# EAGLE design sold (EAGLE 7.6.0)
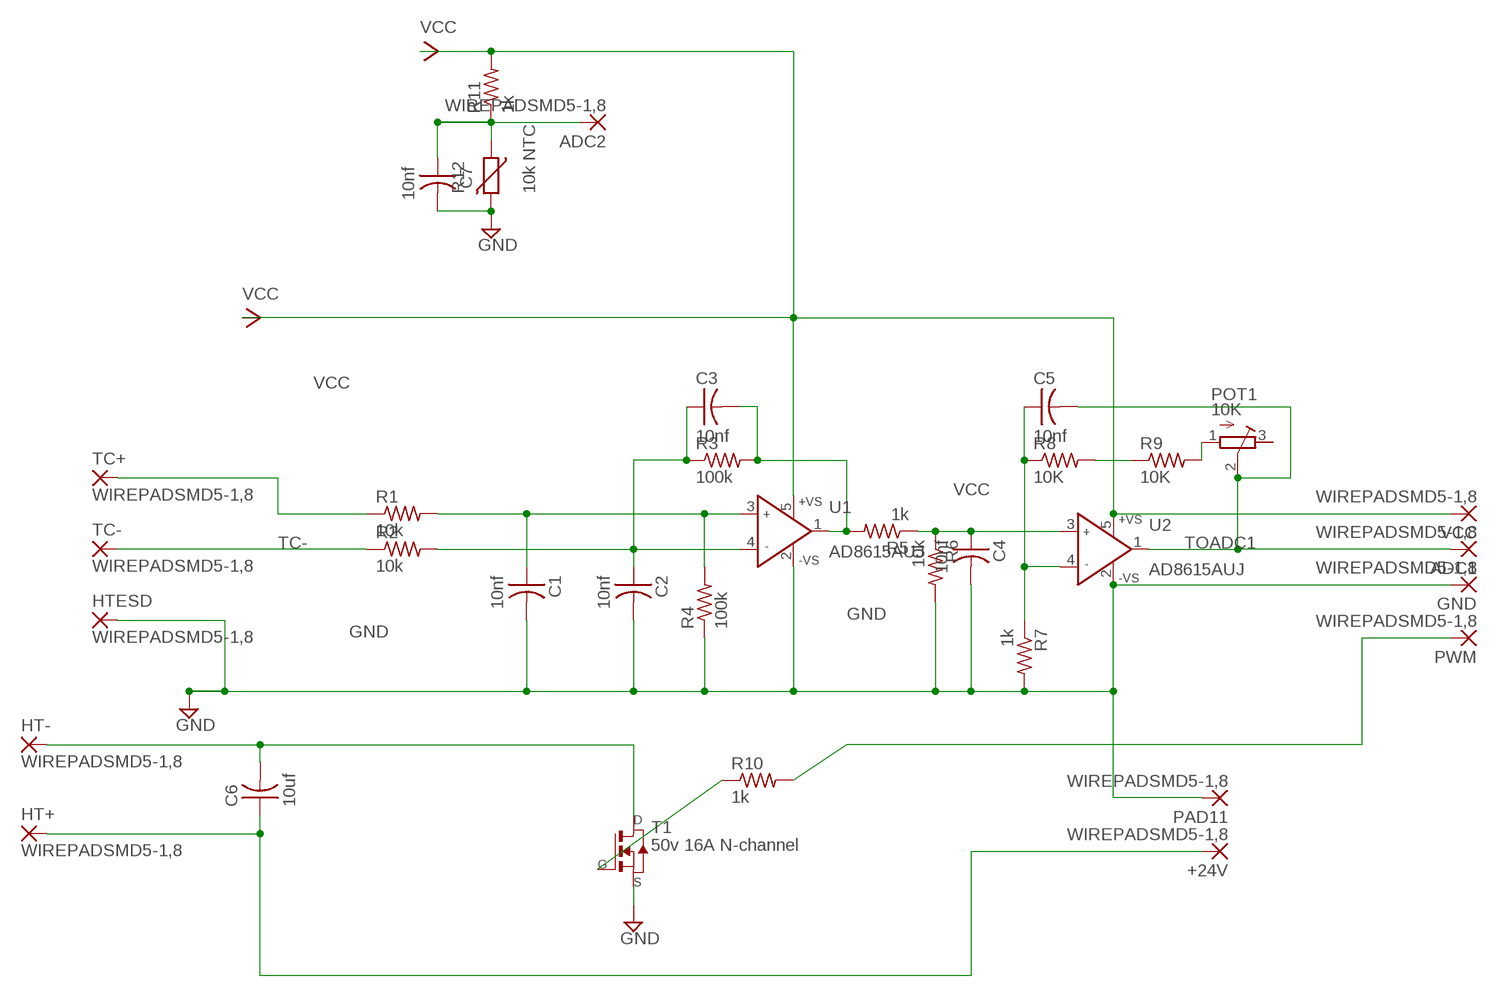
[diagram p0: schematic, sheet 1]

## Parts
+24V  WIREPADSMD5-1,8  [5-1,8]
ADC1  WIREPADSMD5-1,8  [5-1,8]
ADC2  WIREPADSMD5-1,8  [5-1,8]
C1  10nf  CAP-US1206FAB  [C1206FAB]
C2  10nf  CAP-US1206FAB  [C1206FAB]
C3  10nf  CAP-US1206FAB  [C1206FAB]
C4  10nf  CAP-US1206FAB  [C1206FAB]
C5  10nf  CAP-US1206FAB  [C1206FAB]
C6  10uf  CAP-US1206FAB  [C1206FAB]
C7  10nf  CAP-US1206FAB  [C1206FAB]
GND  WIREPADSMD5-1,8  [5-1,8]
HT+  WIREPADSMD5-1,8  [5-1,8]
HT-  WIREPADSMD5-1,8  [5-1,8]
HTESD  WIREPADSMD5-1,8  [5-1,8]
PAD11  WIREPADSMD5-1,8  [5-1,8]
POT1  10K  R-TRIMM3103  [RTRIM3103]
PWM  WIREPADSMD5-1,8  [5-1,8]
R1  10k  RES-US1206FAB  [R1206FAB]
R2  10k  RES-US1206FAB  [R1206FAB]
R3  100k  RES-US1206FAB  [R1206FAB]
R4  100k  RES-US1206FAB  [R1206FAB]
R5  1k  RES-US1206FAB  [R1206FAB]
R6  10k  RES-US1206FAB  [R1206FAB]
R7  1k  RES-US1206FAB  [R1206FAB]
R8  10K  RES-US1206FAB  [R1206FAB]
R9  10K  RES-US1206FAB  [R1206FAB]
R10  1k  RES-US1206FAB  [R1206FAB]
R11  1k  RES-US1206FAB  [R1206FAB]
R12  10k NTC  VARISTORCN1206  [CT/CN1206]
T1  50v 16A N-channel  NMOSFETTO252  [TO252]
TC+  WIREPADSMD5-1,8  [5-1,8]
TC-  WIREPADSMD5-1,8  [5-1,8]
U1  AD8615AUJ  [TSOT23-5]
U2  AD8615AUJ  [TSOT23-5]
VCC  WIREPADSMD5-1,8  [5-1,8]

## Nets
GND: C1.2 C2.2 C4.2 C7.2 GND.1(P) HTESD.1(P) PAD11.1(P) R4.1 R6.2 R7.2 R12.2 T1.2(S) U1.2(-VS) U2.2(-VS)
N$1: C4.1 R5.1 R6.1 U2.3(IN+)
N$2: C2.1 C3.1 R2.2 R3.1 U1.4(IN-)
N$4: C3.2 R3.2 R5.2 U1.1(OUT)
N$5: R1.1 TC+.1(P)
N$6: ADC2.1(P) C7.1 R11.1 R12.1
N$7: C1.1 R1.2 R4.2 U1.3(IN+)
N$8: R8.2 R9.1
N$10: POT1.1(A) R9.2
N$11: C5.1 R7.1 R8.1 U2.4(IN-)
N$12: R10.1 T1.1(G)
N$13: PWM.1(P) R10.2
N$14: +24V.1(P) C6.1 HT+.1(P)
N$15: C6.2 HT-.1(P) T1.3(D)
TC-: R2.1 TC-.1(P)
TOADC1: ADC1.1(P) C5.2 POT1.2(S) U2.1(OUT)
VCC: R11.2 U1.5(+VS) U2.5(+VS) VCC.1(P)
Unconnected: POT1.3(E)

## Library data of the parts
+24V ADC1 ADC2 GND HT+ HT- HTESD PAD11 PWM TC+ TC- VCC = wirepad:WIREPAD: Wire PAD connect wire on PCB
C1-C7 = fab:CAP-US
POT1 = resistor:R-TRIMM: Trimm resistor
R1-R11 = fab:RES-US: Resistor (US Symbol) Variants with postfix FAB are widened to allow the routing of internal traces
R12 = varistor:VARISTOR: VARISTOR
T1 = fab:NMOSFET: MOS FET
U1 U2 = parts:AD8615: Precision, 20 MHz, CMOS, Rail-to-Rail Input/Output Operational Amplifiers; RS: 796-8925

## Board
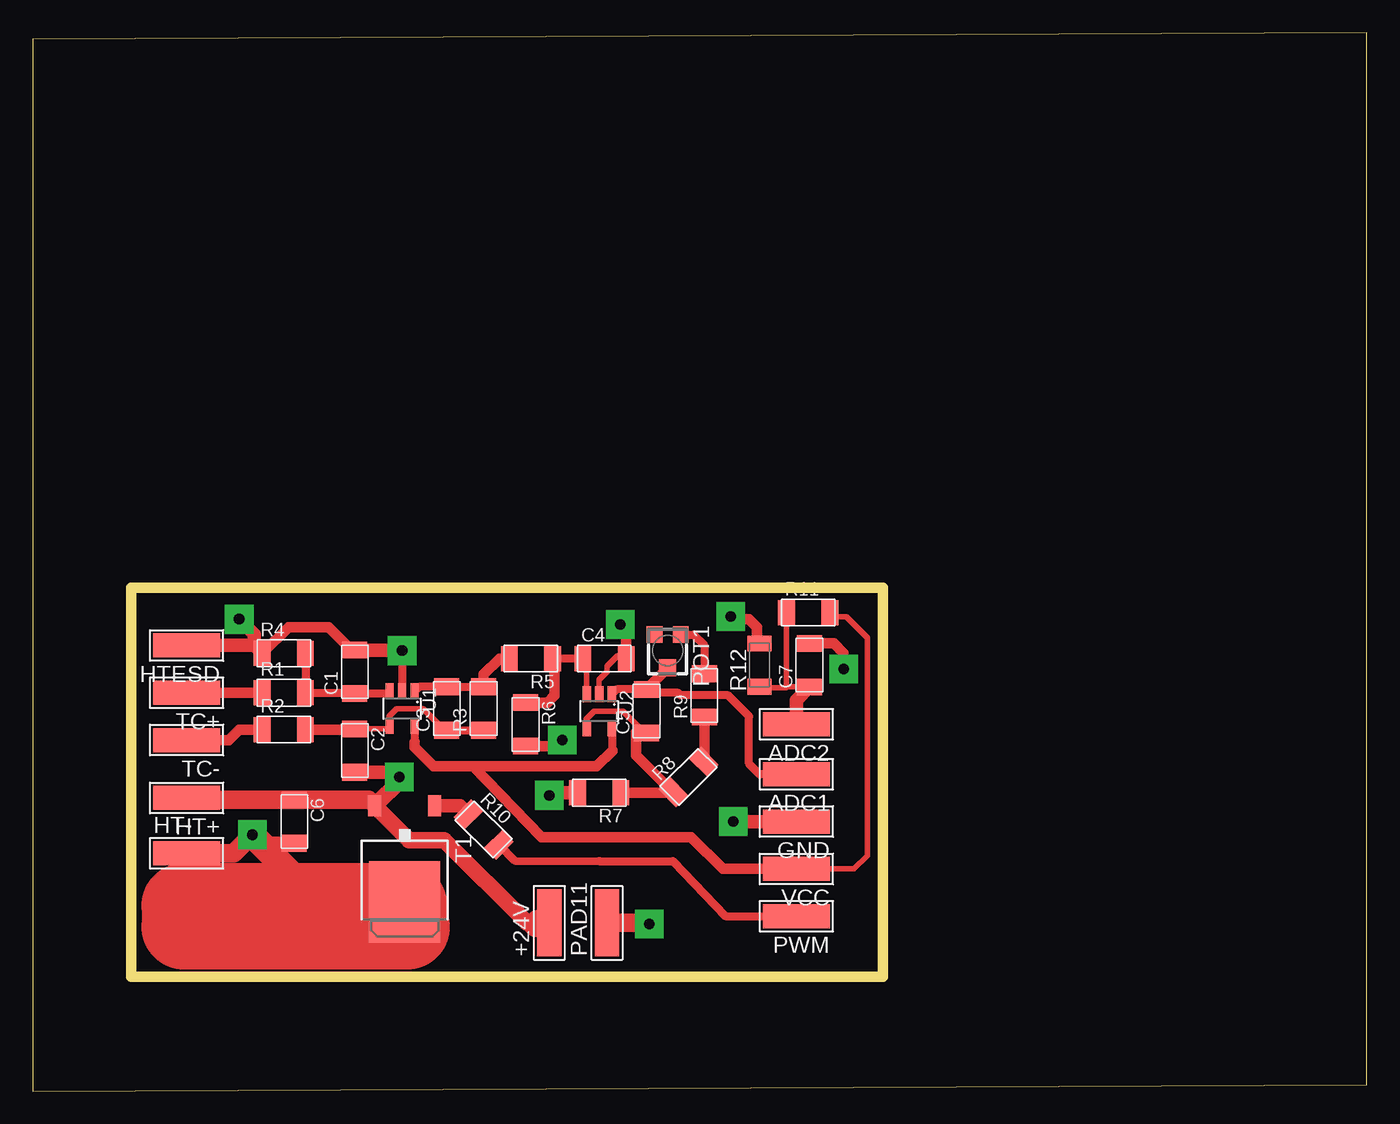
[diagram p1: board, top side]
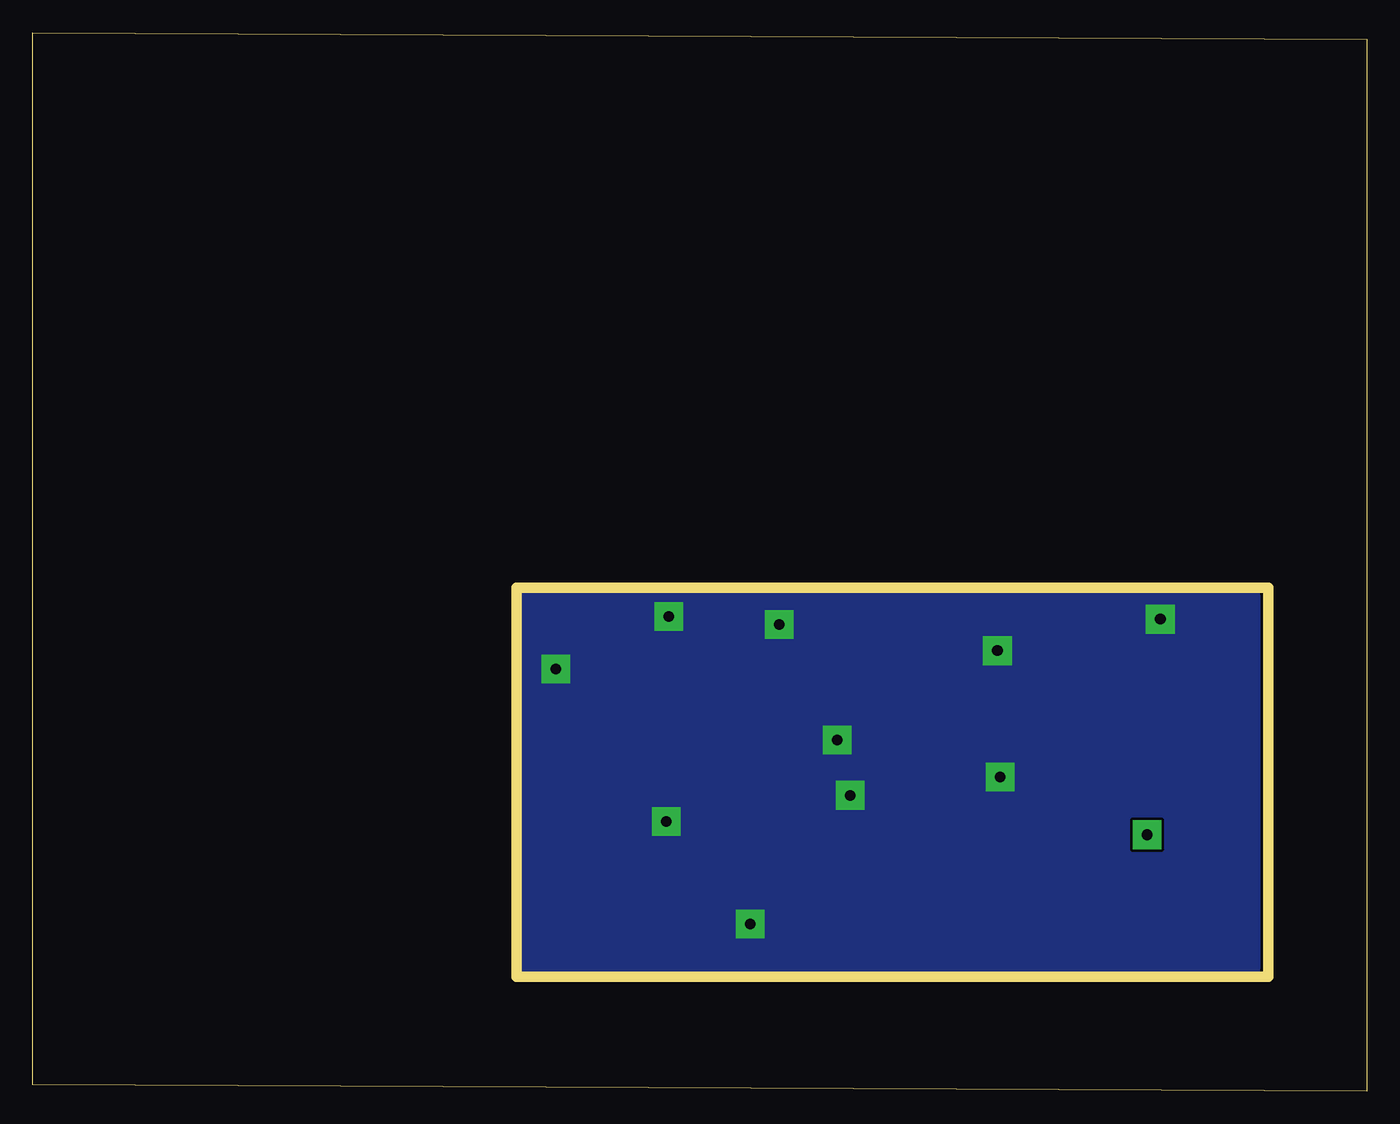
[diagram p2: board, bottom side, seen from below]

Size 101.5 x 80.5 mm. Coordinates in mm from the lower left corner, seen from the top.
Outline: 0,0 101.5,0.5 101.5,80.5 0,80 0,0
Copper layers (1*16): Top 0.035mm / dielectric 1.5mm / Bottom 0.035mm
Design rules "default": minimum track width 10mil, minimum drill 24mil, track to track 8mil, track to pad 8mil, pad to pad 8mil, via to via 8mil, smd to smd 8mil, copper to edge 40mil, drill to drill 8mil, minimum pad ring 10mil, minimum via ring 8mil, stop-mask expansion 4mil, vias tented up to drill 0mil, thermal gap 10mil
Milling: 4 lines

### Footprints (pad centres in the part's own frame; a part is rotated, then mirrored left to right if it is on the bottom)
5-1,8 = smd 1.829 x 5.08: 1 0,0
C1206FAB = smd 1.27 x 1.905: 1 -1.651,0; 2 1.651,0
RTRIM3103 = smd 1.2 x 1.25: 1 -1,-1.225; 3 1,-1.225 | smd 1.3 x 1.3: 2 0,1.3
R1206FAB = smd 1.27 x 1.905: 1 -1.651,0; 2 1.651,0
CT/CN1206 = smd 1.2 x 1.8: 1 -1.65,0; 2 1.65,0
TO252 = smd 1 x 1.6: 1 -2.28,-4.8; 2 2.28,-4.8 | smd 5.4 x 6.2: 3 0,2.5
TSOT23-5 = smd 0.62 x 1.22: 1 -0.95,-1.3; 2 0,-1.3; 3 0.95,-1.3; 4 0.95,1.3; 5 -0.95,1.3

### Placement (x,y rotation side)
+24V  39.3,12.8 0 top
ADC1  58.1,24.1 90 top
ADC2  58.1,27.9 90 top
C1  24.5,31.9 90 top
C2  24.5,25.9 270 top
C3  31.5,29.1 90 top
C4  43.5,32.9 0 top
C5  46.7,28.9 90 top
C6  19.9,20.5 270 top
C7  59.1,32.4 90 top
GND  58.1,20.5 90 top
HT+  11.7,22.3 90 top
HT-  11.7,18.1 270 top
HTESD  11.7,33.9 90 top
PAD11  43.7,12.8 0 top
POT1  48.3,33.5 180 top
PWM  58.1,13.3 90 top
R1  19.1,30.3 0 top
R2  19.1,27.5 0 top
R3  34.3,29.1 90 top
R4  19.1,33.3 0 top
R5  37.9,32.9 180 top
R6  37.5,27.9 270 top
R7  43.1,22.7 180 top
R8  49.9,23.9 45 top
R9  51.1,30.1 90 top
R10  34.3,19.9 315 top
R11  59,36.4 0 top
R12  55.3,32.4 90 top
T1  28.3,16.9 180 top
TC+  11.7,30.3 90 top
TC-  11.7,26.7 90 top
U1  28.1,29.1 180 top
U2  43.1,28.9 180 top
VCC  58.1,16.9 90 top

### Tracks (layer width: path | path; a pad name or v marks a point on that pad's centre or on a via)
GND  (via drill 0.8 pad 2.18)
  Top 0.406: U2.2 43.1,31.3 43.7,31.9 43.7,32.3 44.5,33.1 44.95,33.1 C4.2
  Top 0.61: v28.1,33.5 U1.2
  Top 0.813: C4.2 45.15,35.05 v44.7,35.5 | R6.2 40.25,26.25 40.3,26.3 v40.3,26.7 | R12.2 55.1,34.25 55.1,35.3 54.5,35.9 53.5,35.9 v53.1,36.1 | C7.2 60.95,34.05 61.7,33.3 v61.7,32.1 | 39.7,22.7 v39.3,22.5 | v27.9,23.9 28.1,23.7 27.65,24.25 | R4.1 19.45,35.3 22.5,35.3 24.25,33.55 C1.2
  Top 1.016: HTESD.1 16.85,33.9 | 16.85,33.9 R4.1 | 16.85,33.9 16.85,34.75 v15.7,35.9 | C1.2 28.05,33.55 v28.1,33.5 | C2.2 27.65,24.25 27.7,24.3 | GND.1 v53.3,20.5 | R7.2 39.7,22.7
  Top 1.27: 28.1,23.7 28.02,23.7 T1.2
  Top 1.422: PAD11.1 46.8,12.8 v46.9,12.7
  pour Bottom: 8.1,37.7 64.1,37.7 64.1,9.3 8.1,9.3
  pour Bottom: 8.5,37.1 8.5,9.1 64.7,9.1 64.7,38.1 9.1,38.1 8.5,38.1
N$1
  Top 0.406: 42.15,32.6 U2.3
  Top 0.61: 42.15,32.6 C4.1 R5.1
  Top 0.813: R6.1 39.15,29.55 39.7,30.1 39.7,32.75 R5.1
N$2
  Top 0.406: 30.9,27.5 31.5,27.5 C3.1 31.35,27.45 29.7,29.1 27.7,29.1 27.1,28.5 27.1,27.9 U1.4 26.9,27.55 C2.1
  Top 0.61: C3.1 R3.1
  Top 0.813: R2.2 24.45,27.5 C2.1
N$4
  Top 0.61: R3.2 C3.2 29.4,30.75 U1.1
  Top 0.813: R3.2 34.3,31.7 35.5,32.9 R5.2
N$5
  Top 0.813: R1.1 TC+.1
N$6
  Top 0.406: R11.1 57.35,30.75 | 57.35,30.75 57.3,30.7 55.35,30.7 R12.1 | C7.1 57.35,30.75
  Top 1.016: ADC2.1 58.1,29.75 C7.1
N$7
  Top 0.61: U1.3 27,30.25 C1.1 20.8,30.25 R1.2 R4.2
N$8
  Top 0.813: R9.1 51.1,25.1 R8.2
N$9
  Top 6.452: 28.3,14.1 11.5,14.1 11.5,12.5 28.5,12.5
N$10
  Top 0.61: POT1.1 50.27,34.73 51.1,33.9 R9.2
N$11
  Top 0.406: 45.9,27.3 46.7,27.3 C5.1 46.55,27.25 44.9,28.9 42.7,28.9 42.1,28.3 42.1,27.7 U2.4
  Top 0.813: R7.1 48.7,22.7 R8.1 45.9,25.57 45.9,27.3
N$12
  Top 1.016: T1.1 32.5,21.7 R10.1
N$13
  Top 0.61: R10.2 36.67,17.53 43.1,17.5 48.7,17.5 52.7,13.3 57.1,13.3 57.5,12.9 57.7,12.9 PWM.1
N$14
  Top 1.27: 25.57,22.15 28.62,19.1 31.3,19.1 37.6,12.8 38.7,12.8
  Top 1.422: 25.57,22.15 C6.1 11.85,22.15 HT+.1
  Top 1.93: 38.3,12.7 38.4,12.8 38.7,12.8 +24V.1
N$15  (via drill 0.8 pad 2.18)
  Top 1.016: C6.2 17.35,18.85 v16.7,19.5
  Top 1.422: HT-.1 15.3,18.1 v16.7,19.5
  Top 1.93: T1.3 21.8,14.4 v16.7,19.5
TC-
  Top 0.813: TC-.1 14.9,26.7 15.7,27.5 R2.1
TOADC1
  Top 0.61: U2.1 44.4,30.55 C5.2 46.95,30.3 49.1,30.3 49.3,30.1 52.9,30.1 54.5,28.5 54.5,24.9 55.3,24.1 ADC1.1
  Top 0.813: POT1.2 48.3,32.15 C5.2
VCC
  Top 0.406: VCC.1 62.5,16.9 63.5,17.9 63.5,34.5 61.9,36.1 60.95,36.1 R11.2
  Top 0.61: U1.5 29.05,26.55 | 44.1,25.9 44.1,27.55 U2.5
  Top 0.813: 44.1,25.9 42.9,24.7 33.5,24.7 | 33.5,24.7 30.5,24.7 29.05,26.15 29.05,26.55 | VCC.1 52.5,16.9 50.1,19.3 38.7,19.3 33.5,24.7